# Altium schematic sheet Proximitor Signal Conditioner.SchDoc
size A4; SheetNumber: 1; SheetTotal: 3
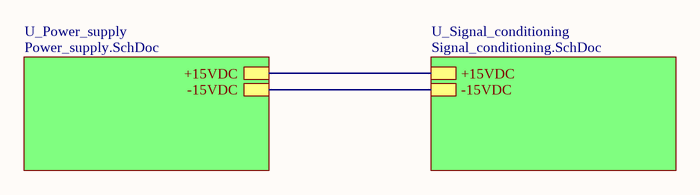
[diagram p0: Proximitor Signal Conditioner.SchDoc]

## Sub-sheets
U_Power_supply = Power_supply.SchDoc: +15VDC, -15VDC
U_Signal_conditioning = Signal_conditioning.SchDoc: +15VDC, -15VDC

## Nets
(unnamed): sheet U_Power_supply/+15VDC, sheet U_Signal_conditioning/+15VDC
(unnamed): sheet U_Power_supply/-15VDC, sheet U_Signal_conditioning/-15VDC